# EAGLE schematic untitled (EAGLE 9.6.2)
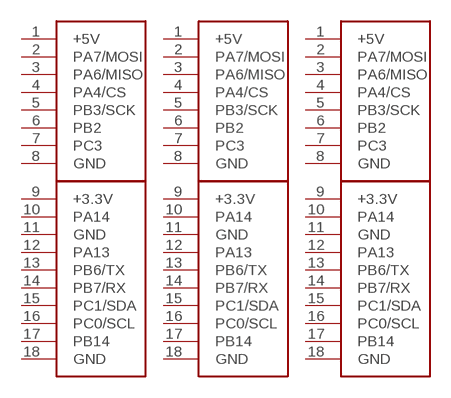
[diagram p0: schematic, sheet 1]

## Parts
U$1  BOTH-TH  [BOTH-TH]
U$2  BOTH-TH  [BOTH-TH]
U$3  BOTH-TH  [BOTH-TH]
Unconnected: U$1.1(+5V) U$1.2(PA7/MOSI) U$1.3(PA6/MISO) U$1.4(PA4/CS) U$1.5(PB3/SCK) U$1.6(PB2) U$1.7(PC3) U$1.8(GND) U$1.9(+3.3V) U$1.10(PA14) U$1.11(GND) U$1.12(PA13) U$1.13(PB6/TX) U$1.14(PB7/RX) U$1.15(PC1/SDA) U$1.16(PC0/SCL) U$1.17(PB14) U$1.18(GND) U$2.1(+5V) U$2.2(PA7/MOSI) U$2.3(PA6/MISO) U$2.4(PA4/CS) U$2.5(PB3/SCK) U$2.6(PB2) U$2.7(PC3) U$2.8(GND) U$2.9(+3.3V) U$2.10(PA14) U$2.11(GND) U$2.12(PA13) U$2.13(PB6/TX) U$2.14(PB7/RX) U$2.15(PC1/SDA) U$2.16(PC0/SCL) U$2.17(PB14) U$2.18(GND) U$3.1(+5V) U$3.2(PA7/MOSI) U$3.3(PA6/MISO) U$3.4(PA4/CS) U$3.5(PB3/SCK) U$3.6(PB2) U$3.7(PC3) U$3.8(GND) U$3.9(+3.3V) U$3.10(PA14) U$3.11(GND) U$3.12(PA13) U$3.13(PB6/TX) U$3.14(PB7/RX) U$3.15(PC1/SDA) U$3.16(PC0/SCL) U$3.17(PB14) U$3.18(GND)

## Library data of the parts
U$1-U$3 = Flipper-Zero-GPIO-Headers:BOTH-TH